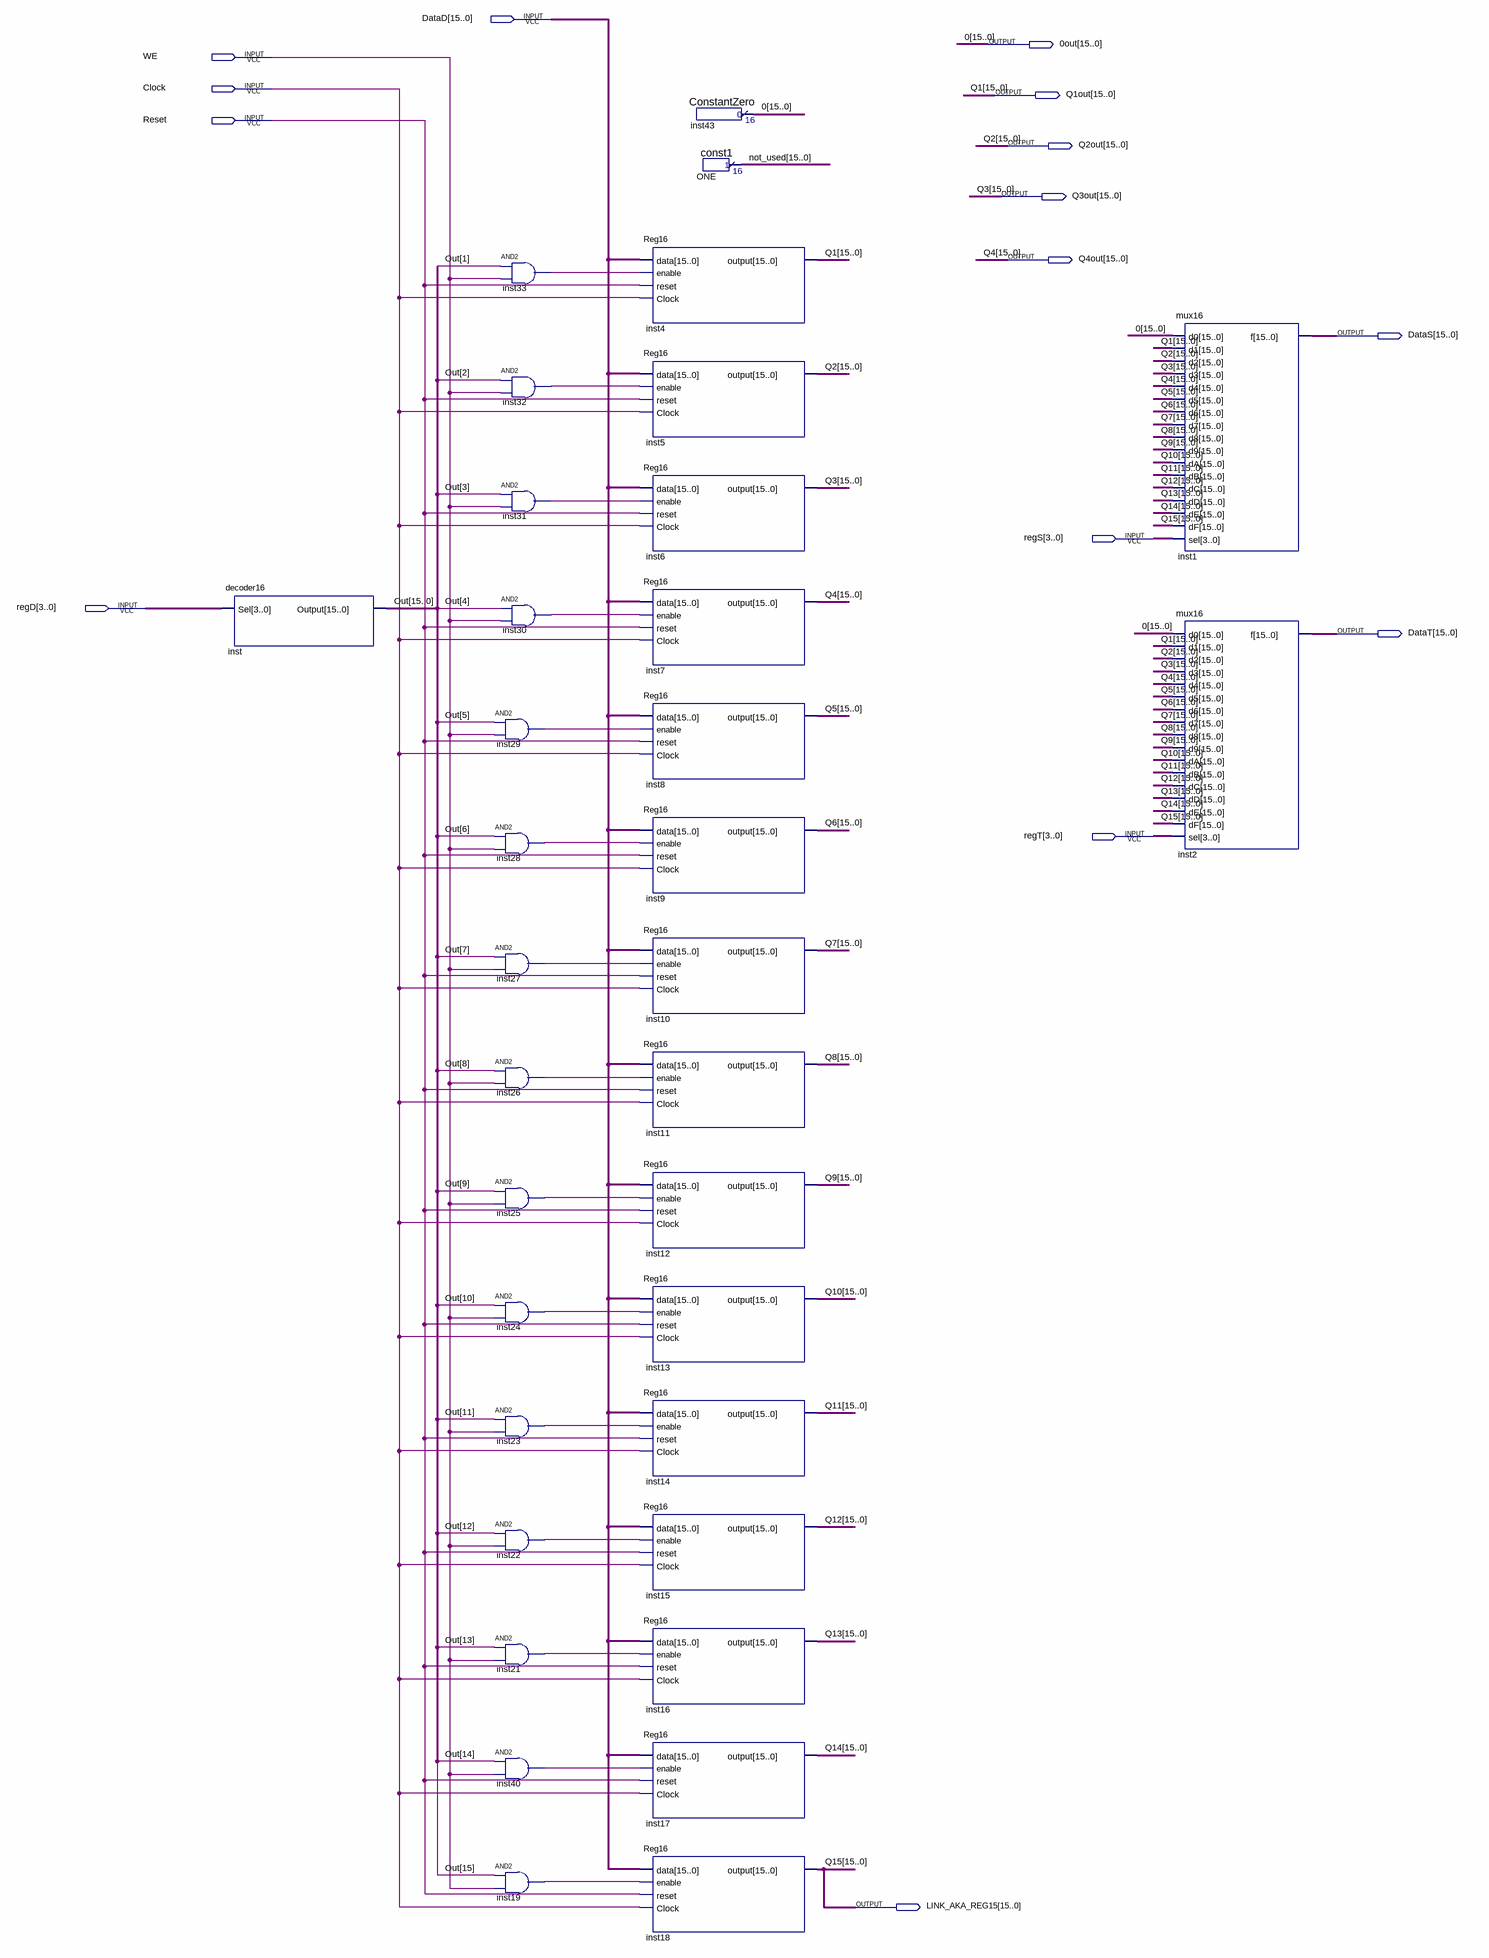
[diagram p0: schematic sheet]
// Quartus schematic registersnewtype.bdf as structural Verilog: 35 symbols, 15 pins
module registersnewtype (
  input  [15:0] DataD,
  input  WE,
  input  Clock,
  input  Reset,
  input  [3:0] regS,
  input  [3:0] regD,
  input  [3:0] regT,
  output [15:0] \0out ,
  output [15:0] Q1out,
  output [15:0] Q2out,
  output [15:0] Q3out,
  output [15:0] Q4out,
  output [15:0] DataS,
  output [15:0] DataT,
  output [15:0] LINK_AKA_REG15
);

  wire inst19_out, inst21_out, inst22_out, inst23_out, inst24_out, inst25_out, inst26_out, inst27_out,
       inst28_out, inst29_out, inst30_out, inst31_out, inst32_out, inst33_out, inst40_out;
  wire [15:0] not_used, Out, Q5, Q6, Q7, Q8, Q9, Q10, Q11, Q12, Q13, Q14;

  decoder16 inst (.Sel(regD), .Output(Out));
  and inst33 (inst33_out, Out[1], WE);
  and inst32 (inst32_out, Out[2], WE);
  and inst31 (inst31_out, Out[3], WE);
  and inst30 (inst30_out, Out[4], WE);
  and inst29 (inst29_out, Out[5], WE);
  and inst28 (inst28_out, Out[6], WE);
  and inst27 (inst27_out, Out[7], WE);
  and inst26 (inst26_out, Out[8], WE);
  and inst25 (inst25_out, Out[9], WE);
  and inst24 (inst24_out, Out[10], WE);
  and inst23 (inst23_out, Out[11], WE);
  and inst22 (inst22_out, Out[12], WE);
  and inst21 (inst21_out, Out[13], WE);
  and inst40 (inst40_out, Out[14], WE);
  and inst19 (inst19_out, Out[15], WE);
  Reg16 inst4 (.data(DataD), .enable(inst33_out), .reset(Reset), .Clock(Clock), .\output (Q1out));
  Reg16 inst5 (.data(DataD), .enable(inst32_out), .reset(Reset), .Clock(Clock), .\output (Q2out));
  Reg16 inst6 (.data(DataD), .enable(inst31_out), .reset(Reset), .Clock(Clock), .\output (Q3out));
  Reg16 inst7 (.data(DataD), .enable(inst30_out), .reset(Reset), .Clock(Clock), .\output (Q4out));
  Reg16 inst8 (.data(DataD), .enable(inst29_out), .reset(Reset), .Clock(Clock), .\output (Q5));
  Reg16 inst9 (.data(DataD), .enable(inst28_out), .reset(Reset), .Clock(Clock), .\output (Q6));
  Reg16 inst10 (.data(DataD), .enable(inst27_out), .reset(Reset), .Clock(Clock), .\output (Q7));
  Reg16 inst11 (.data(DataD), .enable(inst26_out), .reset(Reset), .Clock(Clock), .\output (Q8));
  Reg16 inst12 (.data(DataD), .enable(inst25_out), .reset(Reset), .Clock(Clock), .\output (Q9));
  Reg16 inst13 (.data(DataD), .enable(inst24_out), .reset(Reset), .Clock(Clock), .\output (Q10));
  Reg16 inst14 (.data(DataD), .enable(inst23_out), .reset(Reset), .Clock(Clock), .\output (Q11));
  Reg16 inst15 (.data(DataD), .enable(inst22_out), .reset(Reset), .Clock(Clock), .\output (Q12));
  Reg16 inst16 (.data(DataD), .enable(inst21_out), .reset(Reset), .Clock(Clock), .\output (Q13));
  Reg16 inst17 (.data(DataD), .enable(inst40_out), .reset(Reset), .Clock(Clock), .\output (Q14));
  Reg16 inst18 (.data(DataD), .enable(inst19_out), .reset(Reset), .Clock(Clock), .\output (LINK_AKA_REG15));
  ConstantZero inst43 (.result(\0out ));
  const1 ONE (.result(not_used));
  mux16 inst1 (
    .d0(\0out ), .d1(Q1out), .d2(Q2out), .d3(Q3out), .d4(Q4out), .d5(Q5), .d6(Q6), .d7(Q7), .d8(Q8), .d9(Q9),
    .dA(Q10), .dB(Q11), .dC(Q12), .dD(Q13), .dE(Q14), .dF(LINK_AKA_REG15), .sel(regS), .f(DataS));
  mux16 inst2 (
    .d0(\0out ), .d1(Q1out), .d2(Q2out), .d3(Q3out), .d4(Q4out), .d5(Q5), .d6(Q6), .d7(Q7), .d8(Q8), .d9(Q9),
    .dA(Q10), .dB(Q11), .dC(Q12), .dD(Q13), .dE(Q14), .dF(LINK_AKA_REG15), .sel(regT), .f(DataT));

  // Other names for the same wires on the sheet: 0[15:0] = \0out ; Q15[15:0] = LINK_AKA_REG15; Q1[15:0] = Q1out;
  //   Q2[15:0] = Q2out; Q3[15:0] = Q3out; Q4[15:0] = Q4out
endmodule
